# Altium schematic sheet Display7Seg4511.SCHDOC
size B; SheetNumber: 1; SheetTotal: 1
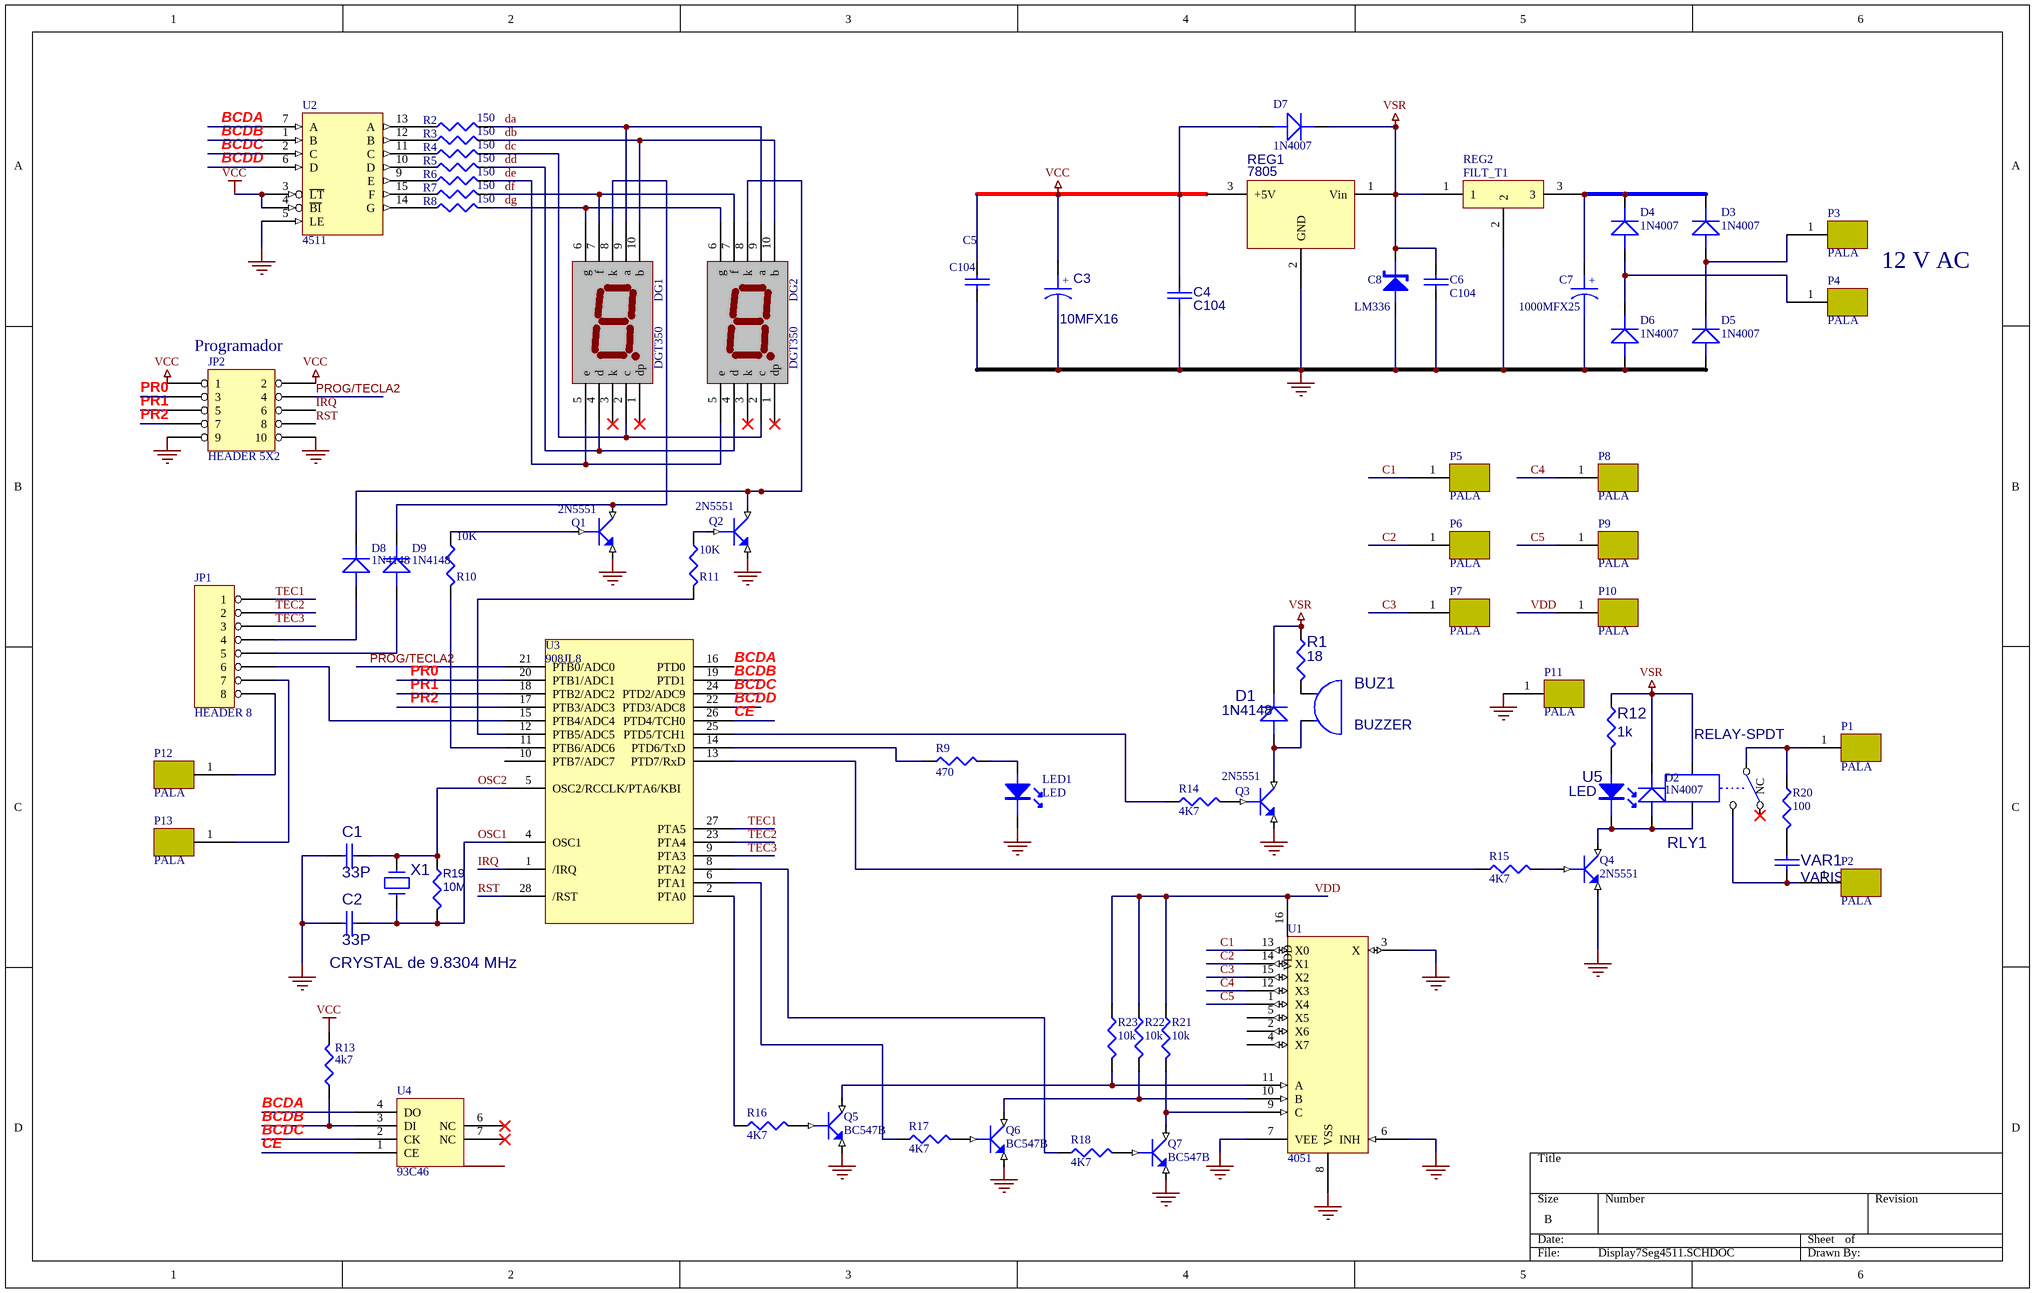
[diagram p0: Display7Seg4511.SCHDOC]

## Parts
BUZ1  BUZZER  [BUZZ]
C1  33P  [CAP0.2]
C2  33P  [CAP0.2]
C3  10MFX16  [RB.1/.2]
C4  C104  [CAP0.2]
C5  C104  [CAP0.2]
C6  C104  [CAP0.2]
C7  1000MFX25  [RB.2/.4]
C8  LM336  [ZEN0.4]
D1  1N4148  [DIODE0.3]
D2  1N4007  [DIODE0.4]
D3  1N4007  [DIODE0.4]
D4  1N4007  [DIODE0.4]
D5  1N4007  [DIODE0.4]
D6  1N4007  [DIODE0.4]
D7  1N4007  [DIODE0.4]
D8  1N4148  [DIODE0.3]
D9  1N4148  [DIODE0.3]
DG1  DGT350  [DIGIT0.7]
DG2  DGT350  [DIGIT0.7]
JP1  HEADER 8  [SIP8]
JP2  HEADER 5X2  [SIP2X5CA]
LED1  LED  [LED3MM]
P1  PALA  [SPADA1-1]
P2  PALA  [SPADA1-1]
P3  PALA  [SPADA1-1]
P4  PALA  [SPADA1-1]
P5  PALA  [SPADA1-1]
P6  PALA  [SPADA1-1]
P7  PALA  [SPADA1-1]
P8  PALA  [SPADA1-1]
P9  PALA  [SPADA1-1]
P10  PALA  [SPADA1-1]
P11  PALA  [SPADA1-1]
P12  PALA  [SPADA1-1]
P13  PALA  [SPADA1-1]
Q1  2N5551  [TO-92A]
Q2  2N5551  [TO-92A]
Q3  2N5551  [TO-92A]
Q4  2N5551  [TO-92A]
Q5  BC547B  [TO-92C]
Q6  BC547B  [TO-92C]
Q7  BC547B  [TO-92C]
R1  18  [AXIAL0.3]
R2  150  [AXIAL0.3]
R3  150  [AXIAL0.3]
R4  150  [AXIAL0.3]
R5  150  [AXIAL0.3]
R6  150  [AXIAL0.3]
R7  150  [AXIAL0.3]
R8  150  [AXIAL0.3]
R9  470  [AXIAL0.3]
R10  10K  [AXIAL0.3]
R11  10K  [AXIAL0.3]
R12  1k  [AXIAL0.3]
R13  4k7  [AXIAL0.3]
R14  4K7  [AXIAL0.3]
R15  4K7  [AXIAL0.3]
R16  4K7  [AXIAL0.3]
R17  4K7  [AXIAL0.3]
R18  4K7  [AXIAL0.3]
R19  10M  [AXIAL0.3]
R20  100  [AXIAL0.6]
R21  10k  [AXIAL0.3]
R22  10k  [AXIAL0.3]
R23  10k  [AXIAL0.3]
REG1  7805  [TO-220V]
REG2  FILT_T1  [FILT_T]
RLY1  RELAY-SPDT  [REL5PCUB]
U1  4051  [DIP16]
U2  4511  [DIP16]
U3  908JL8  [SOL-28]
U4  93C46  [DIP8]
U5  LED  [LED3MM]
VAR1  VARISTOR  [CAP0.4]
X1  CRYSTAL de 9.8304 MHz  [XTAL1]

## Nets
GND: C1.1 C2.1 C3.2 C4.1 C5.2 C6.2 C7.2 C8.1(K) D5.A D6.A JP2.9 JP2.10 LED1.K P11.1 Q1.3(E) Q2.3(E) Q3.3(E) Q4.3(E) Q5.3(E) Q6.3(E) Q7.3(E) REG1.2(GND) REG2.2 U1.3(X) U1.6(INH) U1.7(VEE) U1.8(VSS) U2.5(LE) U2.8(GND) U3.3(GND) U4.5(GND)  [also labelled VSS]
VCC: C3.1 C4.2 C5.1 D7.A JP2.1 JP2.2 R13.2 REG1.3(+5V) U2.3(~{LT}) U2.4(~{BI}) U2.16(VCC) U3.7(VCC) U4.8(VCC)
VDD: P10.1 R21.1 R22.1 R23.1 U1.16(VDD)
VSR: C6.1 C8.2(A) D1.K D2.K D7.K R1.1 R12.1 REG1.1(Vin) REG2.1 RLY1.CO1
BCDA: U2.7(A) U3.16(PTD0) U4.4(DO)
BCDB: R13.1 U2.1(B) U3.19(PTD1) U4.3(DI)
BCDC: U2.2(C) U3.24(PTD2/ADC9) U4.2(CK)
BCDD: U2.6(D) U3.22(PTD3/ADC8)
C1: P5.1 U1.13(X0)
C2: P6.1 U1.14(X1)
C3: P7.1 U1.15(X2)
C4: P8.1 U1.12(X3)
C5: P9.1 U1.1(X4)
CE: U3.26(PTD4/TCH0) U4.1(CE)
da: DG1.9(a) DG2.9(a) R2.2
db: DG1.10(b) DG2.10(b) R3.2
dc: DG1.2(c) DG2.2(c) R4.2
dd: DG1.4(d) DG2.4(d) R5.2
de: DG1.5(e) DG2.5(e) R6.2
df: DG1.7(f) DG2.7(f) R7.2
dg: DG1.6(g) DG2.6(g) R8.2
IRQ: JP2.6 U3.1(/IRQ)
OSC1: C2.2 R19.2 U3.4(OSC1) X1.1
OSC2: C1.2 R19.1 U3.5(OSC2/RCCLK/PTA6/KBI) X1.2
PR0: JP2.3 U3.20(PTB1/ADC1)
PR1: JP2.5 U3.18(PTB2/ADC2)
PR2: JP2.7 U3.17(PTB3/ADC3)
PROG/TECLA2: JP2.4 U3.21(PTB0/ADC0)
RST: JP2.8 U3.28(/RST)
TEC1: JP1.1 U3.27(PTA5)
TEC2: JP1.2 U3.23(PTA4)
TEC3: JP1.3 U3.9(PTA3)
NetBUZ1_1: BUZ1.1 R1.2
NetBUZ1_2: BUZ1.2 D1.A Q3.1(C)
NetC7_1: C7.1 D3.K D4.K REG2.3
NetD2_A: D2.A Q4.1(C) RLY1.CO2 U5.K
NetD3_A: D3.A D5.K P3.1
NetD4_A: D4.A D6.K P4.1
NetD8_A: D8.A JP1.4
NetD8_K: D8.K DG2.8(k) Q2.1(C)
NetD9_A: D9.A JP1.5
NetD9_K: D9.K DG1.8(k) Q1.1(C)
NetJP1_6: JP1.6 U3.15(PTB4/ADC4)
NetJP1_7: JP1.7 P13.1
NetJP1_8: JP1.8 P12.1
NetLED1_A: LED1.A R9.2
NetP1_1: P1.1 R20.1 RLY1.COM
NetP2_1: P2.1 RLY1.NA VAR1.1
NetQ1_2: Q1.2(B) R10.1
NetQ2_2: Q2.2(B) R11.1
NetQ3_2: Q3.2(B) R14.2
NetQ4_2: Q4.2(B) R15.2
NetQ5_1: Q5.1(C) R23.2 U1.11(A)
NetQ5_2: Q5.2(B) R16.2
NetQ6_1: Q6.1(C) R22.2 U1.10(B)
NetQ6_2: Q6.2(B) R17.2
NetQ7_1: Q7.1(C) R21.2 U1.9(C)
NetQ7_2: Q7.2(B) R18.2
NetR2_1: R2.1 U2.13(A)
NetR3_1: R3.1 U2.12(B)
NetR4_1: R4.1 U2.11(C)
NetR5_1: R5.1 U2.10(D)
NetR6_1: R6.1 U2.9(E)
NetR7_1: R7.1 U2.15(F)
NetR8_1: R8.1 U2.14(G)
NetR9_1: R9.1 U3.14(PTD6/TxD)
NetR10_2: R10.2 U3.11(PTB6/ADC6)
NetR11_2: R11.2 U3.12(PTB5/ADC5)
NetR12_2: R12.2 U5.A
NetR14_1: R14.1 U3.25(PTD5/TCH1)
NetR15_1: R15.1 U3.13(PTD7/RxD)
NetR16_1: R16.1 U3.2(PTA0)
NetR17_1: R17.1 U3.6(PTA1)
NetR18_1: R18.1 U3.8(PTA2)
NetR20_2: R20.2 VAR1.2

Not connected (* = marked no-connect by the designer): DG1 1(dp)* 3(k)*; DG2 1(dp)* 3(k)*; RLY1 NC*; U1 2(X6) 4(X7) 5(X5); U3 10(PTB7/ADC7); U4 6(NC)* 7(NC)*

## Notes on the sheet
- 12 V AC
- (near JP2) Programador
- (in symbol 10MFX16) +
- (in symbol 1000MFX50) +

## Library data of the parts
BUZ1 = BUZZER: Text Field1: 0.957
C1 C2 = 33P: CAPACITOR CERANICO; Text Field1: 0,017
C3 = 10MFX16: CAPACITOR ELECTROLITICO; Text Field1: ,021
C4-C6 = C104: CAPACITOR MULTICAPA; Text Field1: ,028
C7 = 1000MFX50: CAPACITOR ELECTROLITICO; Text Field1: 0,150
C8 = LM336: DIODO ZENER; Text Field1: 0.4
D1-D9 = 1N4148: DIODO DE SEÑAL; Text Field1: 0,012
DG1 DG2 = DGT350: DIGITO DE 1/2 PULGADA; Text Field1: 0,4; 0.54: *
JP1 = 8 HEADER
LED1 U5 = LED: Text Field1: 0,04
P1-P13 = PALA: BORNERA ENCHUF. MACHO/HEMBRA; Text Field1: 0,023
Q1-Q4 = 2N5551: NPN Bipolar Transistor; Text Field1: 0,05
Q5-Q7 = MPSA13: NPN Bipolar Transistor; Text Field1: 0,.056
R1-R23 = RES: Resistor; Text Field1: 0,012
REG1 = MC7805: REGULADOR 5V - 1 A; Text Field1: ,25
RLY1 = RELAY-SPDT: RELAY SIMPLE INVERSOR 12 V; Text Field1: 0.45
U1 = 4051: MULTIPLEXOR; Text Field1: 0,43
U2 = 4511: INTEGRADO; Text Field1: 0,35; Text Field2: BCD / 7 SEG
U3 = 908JL8: 908JL
U4 = 93C46: INTEGRADO; Text Field1: 0,53; Text Field2: MEMORIA SEEPROM
VAR1 = VARISTOR: VARISTOR 250V; Text Field1: 0,14
X1 = CRYSTAL: CRISTAL; Text Field1: 0,385